# Altium schematic sheet Power_control_Sys.SchDoc
size A
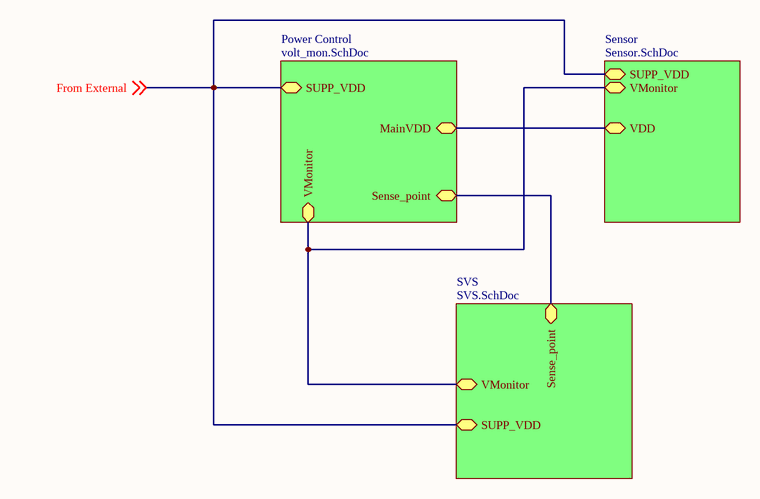
[diagram p0: Power_control_Sys.SchDoc]

## Sub-sheets
Power Control = volt_mon.SchDoc: MainVDD, VMonitor, SUPP_VDD, Sense_point
Sensor = Sensor.SchDoc: VDD, VMonitor, SUPP_VDD
SVS = SVS.SchDoc: VMonitor, SUPP_VDD, Sense_point

## Nets
From External: off-sheet From External, sheet Power Control/SUPP_VDD, sheet Sensor/SUPP_VDD, sheet SVS/SUPP_VDD
(unnamed): sheet Power Control/MainVDD, sheet Sensor/VDD
(unnamed): sheet Power Control/VMonitor, sheet Sensor/VMonitor, sheet SVS/VMonitor
(unnamed): sheet Power Control/Sense_point, sheet SVS/Sense_point